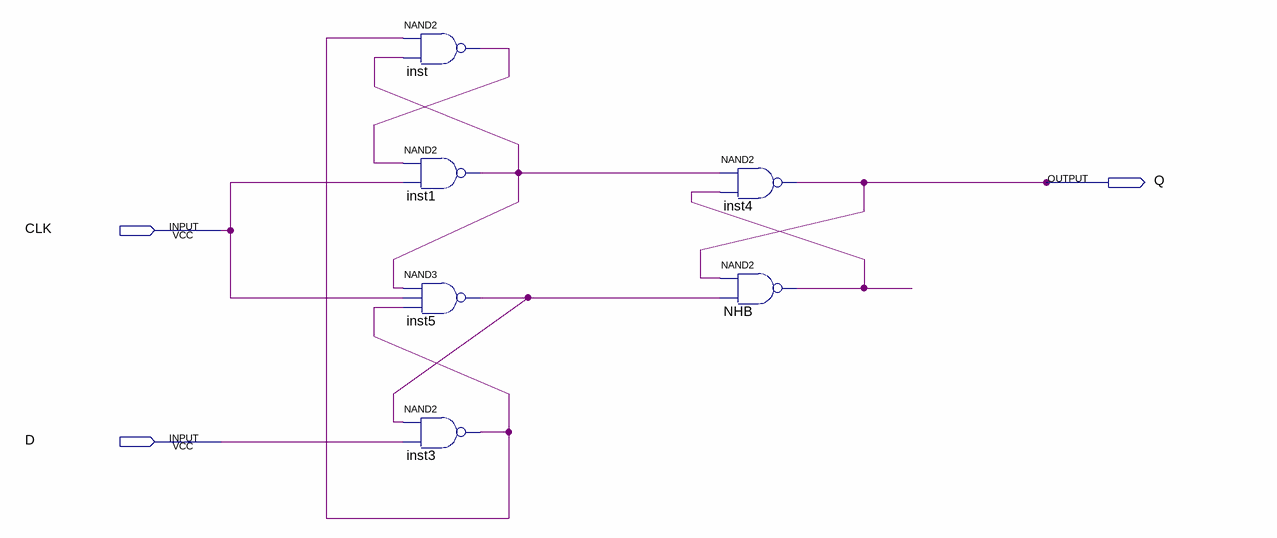
[diagram p0: schematic sheet]
// Quartus schematic DFF.bdf as structural Verilog: 6 symbols, 3 pins
module DFF (
  input  CLK,
  input  D,
  output Q
);

  wire inst1_out, inst3_out, inst5_out, inst_out, NHB_out;

  nand inst (inst_out, inst3_out, inst1_out);
  nand inst1 (inst1_out, inst_out, CLK);
  nand inst5 (inst5_out, inst1_out, CLK, inst3_out);
  nand inst3 (inst3_out, inst5_out, D);
  nand inst4 (Q, inst1_out, NHB_out);
  nand NHB (NHB_out, Q, inst5_out);
endmodule
